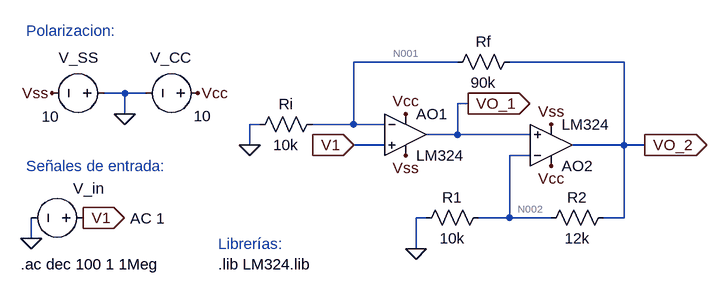
[diagram p0: schematic Lab_3_Circ_1-Respuesta en frecuencia.asc]
Lab_3_Circ_1-Respuesta en frecuencia.asc, the LTspice schematic file:
Version 4
SHEET 1 1764 680
WIRE 544 -304 384 -304
WIRE 800 -304 624 -304
WIRE 32 -256 0 -256
WIRE 64 -256 32 -256
WIRE 560 -240 544 -240
WIRE 32 -224 32 -256
WIRE 240 -208 224 -208
WIRE 384 -208 384 -304
WIRE 384 -208 320 -208
WIRE 432 -208 384 -208
WIRE 544 -192 544 -240
WIRE 544 -192 496 -192
WIRE 656 -192 544 -192
WIRE 224 -176 224 -208
WIRE 432 -176 384 -176
WIRE 800 -176 800 -304
WIRE 800 -176 720 -176
WIRE 832 -176 800 -176
WIRE 656 -160 624 -160
WIRE 496 -64 480 -64
WIRE 624 -64 624 -160
WIRE 624 -64 576 -64
WIRE 688 -64 624 -64
WIRE 800 -64 800 -176
WIRE 800 -64 768 -64
WIRE -112 -32 -112 -64
WIRE 480 -16 480 -64
FLAG 144 -256 Vcc
FLAG -80 -256 Vss
FLAG 32 -224 0
FLAG -112 -32 0
FLAG -32 -64 V1
IOPIN -32 -64 Out
FLAG 464 -224 Vcc
FLAG 464 -160 Vss
FLAG 384 -176 V1
IOPIN 384 -176 In
FLAG 832 -176 VO_2
IOPIN 832 -176 Out
FLAG 688 -144 Vcc
FLAG 688 -208 Vss
FLAG 224 -176 0
FLAG 560 -240 VO_1
IOPIN 560 -240 Out
FLAG 480 -16 0
SYMBOL voltage -16 -64 M270
WINDOW 0 45 31 VLeft 2
WINDOW 3 1 -53 VLeft 2
WINDOW 123 -1 -56 VLeft 2
WINDOW 39 0 0 Left 0
SYMATTR InstName V_in
SYMATTR Value ""
SYMATTR Value2 AC 1
SYMBOL voltage 160 -256 R90
WINDOW 0 -55 25 VRight 2
WINDOW 3 35 -5 VRight 2
WINDOW 123 0 0 Left 0
WINDOW 39 0 0 Left 0
SYMATTR InstName V_CC
SYMATTR Value 10
SYMBOL voltage 16 -256 R90
WINDOW 0 -55 25 VRight 2
WINDOW 3 36 85 VRight 2
WINDOW 123 0 0 Left 0
WINDOW 39 0 0 Left 0
SYMATTR InstName V_SS
SYMATTR Value 10
SYMBOL OpAmps\\opamp2 464 -256 R0
SYMATTR InstName AO1
SYMATTR Value LM324
SYMBOL OpAmps\\opamp2 688 -112 M180
SYMATTR InstName AO2
SYMATTR Value LM324
SYMBOL res 640 -320 R90
WINDOW 0 0 56 VBottom 2
WINDOW 3 32 56 VTop 2
SYMATTR InstName Rf
SYMATTR Value 90k
SYMBOL res 336 -224 R90
WINDOW 0 0 56 VBottom 2
WINDOW 3 32 56 VTop 2
SYMATTR InstName Ri
SYMATTR Value 10k
SYMBOL res 784 -80 R90
WINDOW 0 0 56 VBottom 2
WINDOW 3 32 56 VTop 2
SYMATTR InstName R2
SYMATTR Value 12k
SYMBOL res 480 -48 R270
WINDOW 0 32 56 VTop 2
WINDOW 3 0 56 VBottom 2
SYMATTR InstName R1
SYMATTR Value 10k
TEXT 176 8 Left 2 !.lib LM324.lib
TEXT 176 -24 Left 2 ;Librerías:
TEXT -120 -352 Left 2 ;Polarizacion:
TEXT -120 -144 Left 2 ;Señales de entrada:
TEXT -128 8 Left 2 !.ac dec 100 1 1Meg

The netlist it stands for:
* Lab_3_Circ_1-Respuesta en frecuencia.asc
V_in V1 0 AC 1
V_CC Vcc 0 10
V_SS 0 Vss 10
XAO1 V1 N001 Vcc Vss VO_1 LM324  ; pins In+ In- V+ V- OUT
XAO2 VO_1 N002 Vcc Vss VO_2 LM324  ; pins In+ In- V+ V- OUT
Rf VO_2 N001 90k
Ri N001 0 10k
R2 VO_2 N002 12k
R1 0 N002 10k
.lib LM324.lib
* Librerías:
* Polarizacion:
* Señales de entrada:
.ac dec 100 1 1Meg
.backanno
.end

* Results of the author's LTspice run, read from the files saved beside the schematic
* Operating Point, zero values left out:
*   V(vcc) = 10 V
*   V(vss) = -10 V
*   V(vo_1) = -826.3 µV
*   V(n001) = -33.65 µV
*   V(vo_2) = -2.131 mV
*   V(n002) = -859.9 µV
*   I(R1) = 85.99 nA
*   I(R2) = -105.9 nA
*   I(Ri) = -3.365 nA
*   I(Rf) = -23.3 nA
*   I(V_ss) = -1.34 mA
*   I(V_cc) = -1.34 mA
*   I(V_in) = 19.92 nA
*   Ix(ao1:1) = -19.92 nA
*   Ix(ao1:2) = -19.94 nA
*   Ix(ao1:3) = 669.9 µA
*   Ix(ao1:4) = -669.8 µA
*   Ix(ao1:5) = 19.92 nA
*   Ix(ao2:1) = -19.92 nA
*   Ix(ao2:2) = -19.94 nA
*   Ix(ao2:3) = 669.9 µA
*   Ix(ao2:4) = -669.8 µA
*   Ix(ao2:5) = 129.2 nA
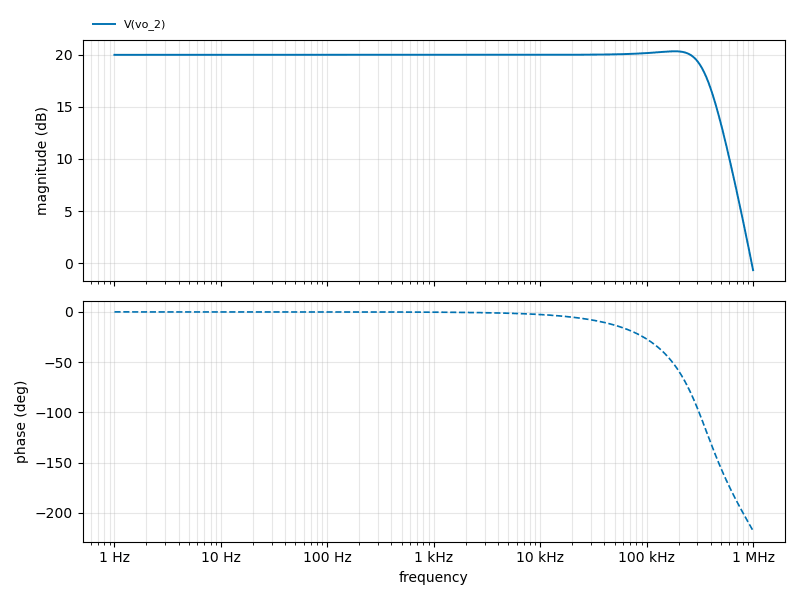
[diagram p1: AC Analysis of Lab_3_Circ_1-Respuesta en frecuencia.asc, plotted from the saved traces]
* AC Analysis, 1 run:
*   V(vo_2): 20.00 dB at 1 Hz, -0.67 dB at 1 MHz, peak 20.34 dB at 182 kHz, 3 dB below the peak at 381.4 kHz